# Altium schematic sheet Modified_Dub_Siren.SchDoc
size Legal; SheetNumber: 1; SheetTotal: 1; ENG_APP_DATE: --/--/--; DSN_APP_DATE: --/--/--; CHK_APP_DATE: --/--/--
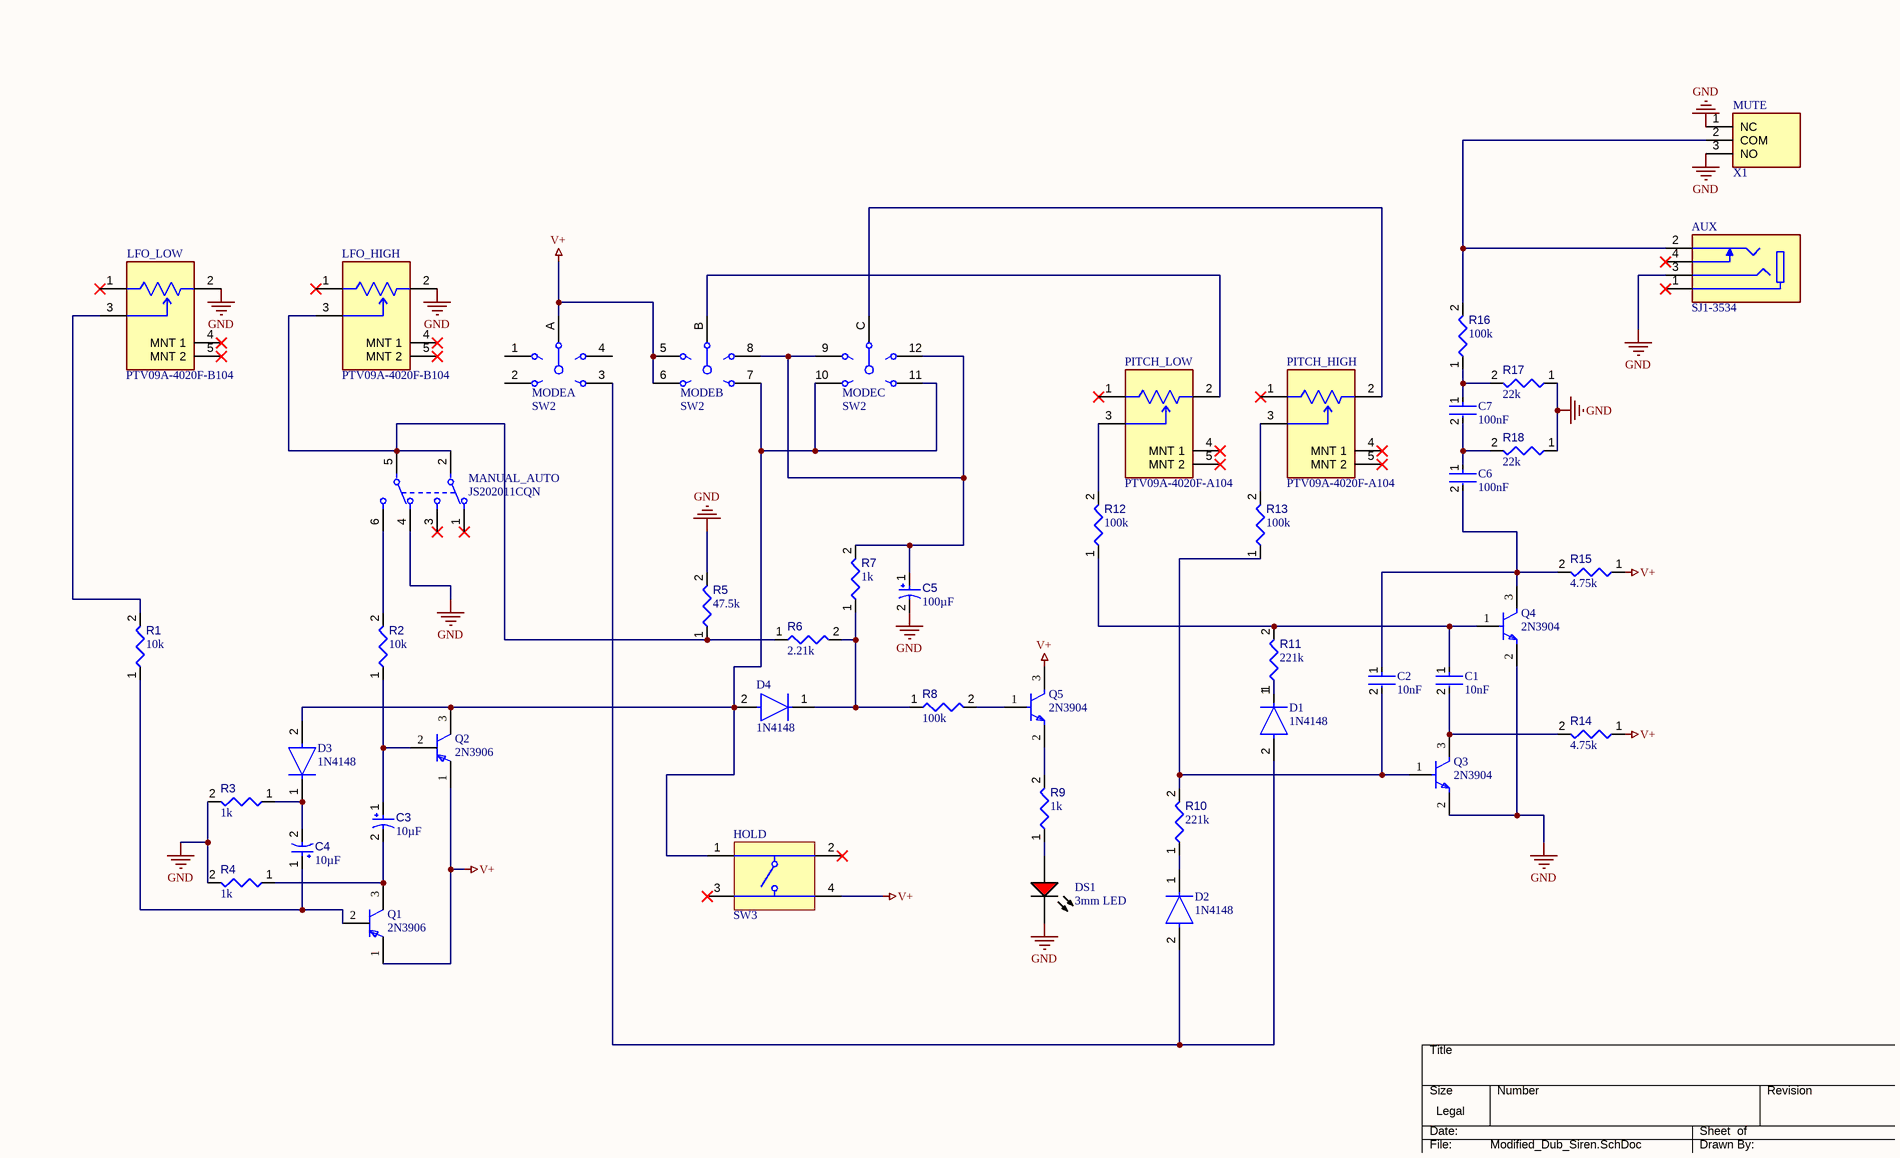
[diagram p0: Modified_Dub_Siren.SchDoc]

## Parts
AUX  SJ1-3534  [CUI_SJ1-3533]
C1  10nF  [FP-K15H5-MFG]
C2  10nF  [FP-K15H5-MFG]
C3  value 10µF  [CAPPR55-200-1100X500X1200]  (hidden comment: ECA1HM100)
C4  value 10µF  [CAPPR55-200-1100X500X1200]  (hidden comment: ECA1HM100)
C5  value 100µF  [CAPPR55-200-1100X500X1200]  (hidden comment: ECA1HM100)
C6  100nF  [FP-K15H5-MFG]
C7  100nF  [FP-K15H5-MFG]
D1  1N4148  [FP-017AG-MFG]
D2  1N4148  [FP-017AG-MFG]
D3  1N4148  [FP-017AG-MFG]
D4  1N4148  [FP-017AG-MFG]
DS1  3mm LED  [LED-2P-2.28-3MM_A]
HOLD  SW3  [BEST-TS-1109_V]
LFO_HIGH  PTV09A-4020F-B104  [FP-PTV09A-4020-MFG]
LFO_LOW  PTV09A-4020F-B104  [FP-PTV09A-4020-MFG]
MANUAL_AUTO  JS202011CQN  [FP-JS202011AQN-MFG]
MODE  SW2  [CKCP-A30415RNZQ-15_V]  (parts A,B,C of 3)
MUTE  X1  [100SP5T1B1M2QEH]
PITCH_HIGH  PTV09A-4020F-A104  [FP-PTV09A-4020-MFG]
PITCH_LOW  PTV09A-4020F-A104  [FP-PTV09A-4020-MFG]
Q1  2N3906  [FP-135AR-MFG]
Q2  2N3906  [FP-135AR-MFG]
Q3  2N3904  [FP-135AR-MFG]
Q4  2N3904  [FP-135AR-MFG]
Q5  2N3904  [FP-135AR-MFG]
R1  value 10k  [RESA60-630X240]  (hidden comment: MFR-25FBF52-10K)
R2  value 10k  [RESA60-630X240]  (hidden comment: MFR-25FBF52-10K)
R3  value 1k  [RESA60-630X240]  (hidden comment: MFR-25FBF52-1K)
R4  value 1k  [RESA60-630X240]  (hidden comment: MFR-25FBF52-1K)
R5  value 47.5k  [RESA60-630X240]  (hidden comment: MFR-25FBF52-47K5)
R6  value 2.21k  [RESA60-630X240]  (hidden comment: MFR-25FBF52-2K21)
R7  value 1k  [RESA60-630X240]  (hidden comment: MFR-25FBF52-1K)
R8  value 100k  [RESA60-630X240]  (hidden comment: MFR-25FBF52-100K)
R9  value 1k  [RESA60-630X240]  (hidden comment: MFR-25FBF52-1K)
R10  value 221k  [RESA60-630X240]  (hidden comment: MFR-25FBF52-221K)
R11  value 221k  [RESA60-630X240]  (hidden comment: MFR-25FBF52-221K)
R12  value 100k  [RESA60-630X240]  (hidden comment: MFR-25FBF52-100K)
R13  value 100k  [RESA60-630X240]  (hidden comment: MFR-25FBF52-100K)
R14  value 4.75k  [RESA60-630X240]  (hidden comment: MFR-25FBF52-4K75)
R15  value 4.75k  [RESA60-630X240]  (hidden comment: MFR-25FBF52-4K75)
R16  value 100k  [RESA60-630X240]  (hidden comment: MFR-25FBF52-100K)
R17  value 22k  [RESA60-630X240]  (hidden comment: MFR-25FBF52-22K1)
R18  value 22k  [RESA60-630X240]  (hidden comment: MFR-25FBF52-22K1)

## Nets
GND: AUX.3 C5.2 DS1.2(K) LFO_HIGH.2 LFO_LOW.2 MANUAL_AUTO.4 MUTE.1(NC) MUTE.3(NO) Q3.2(E) Q4.2(E) R3.2 R4.2 R5.2 R17.1 R18.1
V+: HOLD.4 MODE.5 MODE.6 MODE.A Q1.1(E) Q2.1(E) Q5.3(C) R14.1 R15.1
NetAUX_2: AUX.2 MUTE.2(COM) R16.2
NetC1_1: C1.1 Q4.1(B) R11.2 R12.1
NetC1_2: C1.2 Q3.3(C) R14.2
NetC2_1: C2.1 C6.2 Q4.3(C) R15.2
NetC2_2: C2.2 Q3.1(B) R10.2 R13.1
NetC3_1: C3.1 Q2.2(B) R2.1
NetC3_2: C3.2 Q1.3(C) R4.1
NetC4_1: C4.1 Q1.2(B) R1.1
NetC4_2: C4.2 D3.1(C) R3.1
NetC5_1: C5.1 MODE.8 MODE.9 MODE.12 R7.2
NetC6_1: C6.1 C7.2 R18.2
NetC7_1: C7.1 R16.1 R17.2
NetD1_1: D1.1(C) R11.1
NetD1_2: D1.2(A) D2.2(A) MODE.3
NetD2_1: D2.1(C) R10.1
NetD3_2: D3.2(A) D4.2(A) HOLD.1 MODE.7 MODE.10 MODE.11 Q2.3(C)
NetD4_1: D4.1(C) R6.2 R7.1 R8.1
NetDS1_1: DS1.1(A) R9.1
NetLFO_HIGH_3: LFO_HIGH.3 MANUAL_AUTO.2 MANUAL_AUTO.5 R5.1 R6.1
NetLFO_LOW_3: LFO_LOW.3 R1.2
NetMANUAL_AUTO_6: MANUAL_AUTO.6 R2.2
NetMODE_B: MODE.B PITCH_LOW.2
NetMODE_C: MODE.C PITCH_HIGH.2
NetPITCH_HIGH_3: PITCH_HIGH.3 R13.2
NetPITCH_LOW_3: PITCH_LOW.3 R12.2
NetQ5_1: Q5.1(B) R8.2
NetQ5_2: Q5.2(E) R9.2

Not connected (* = marked no-connect by the designer): AUX 1* 4*; HOLD 2* 3*; LFO_HIGH 1* 4(MNT_1)* 5(MNT_2)*; LFO_LOW 1* 4(MNT_1)* 5(MNT_2)*; MANUAL_AUTO 1* 3*; MODE 1 2 4; PITCH_HIGH 1* 4(MNT_1)* 5(MNT_2)*; PITCH_LOW 1* 4(MNT_1)* 5(MNT_2)*

## Notes on the sheet
- DWG NO:
- REV:
- THIS DOCUMENT AND THE DATA DISCLOSED HEREIN OR
- HEREWITH IS THE PROPERTY OF ALTIUM LIMITED AND MAY
- BE FREELY DISTRIBUTED IN WHOLE. NO RIGHTS ARE
- RESERVED OR EXPRESS OR IMPLIED WARANTEE GIVEN.
- REVISION
- DESCRIPTION
- DATE
- APPROVED
- ENG:
- APPROVALS
- PROJECT
- DSN:
- CHK:
- REFERENCE DOCUMENTS
- PROJECT REVISION:
- TITLE
- DOCUMENT REVISION:
- DESIGN ITEM:
- BOM:
- FAB DWG:
- PCB DWG:
- ASSY DWG:
- SCALE:
- A2
- SIZE
- CAGE CODE
- FILE NAME
- DWG NO.
- SHEET
- OF
- REV

## Library data of the parts
AUX = SJ1-3534: 3.5 mm Right-Angle Stereo Jack, 4 Pin PCB Mount, Threaded w/ Nut; MF: Same Sky; SnapEDA_Link: https://www.snapeda.com/parts/SJ1-3534/Same+Sky/view-part/?ref=snap; Package: None; Value: *; MP: SJ1-3534; Check_prices: https://www.snapeda.com/parts/SJ1-3534/Same+Sky/view-part/?ref=eda
C1 C2 = CMP-02417-000048-1: CAP CER 0.1UF 50V X7R RADIAL; Capacitance: 100nF; Tolerance: 10%; Lead/Base Style: Formed Leads; Lead Length: 30mm; Lead Diameter: 0.5mm; Radiation Hardening: No; Lead Pitch: 5mm; Voltage: 50V; Mount: Through Hole; Package Quantity: 5000; Series: K; Case/Package: Dipped; Min Operating Temperature: -55°C; Depth: 2.5mm; Height - Seated (Max): 0.1inch; Voltage Rating (DC): 50V; Packaging: Bulk; RoHS Compliant: Yes; Construction: RADIAL; Thickness: 2.6mm; Max Operating Temperature: 125°C; Voltage Rating: 50V; Diameter: 500um; Dielectric: X7R; Width: 2.5mm; Length: 4mm; Weight: 0.005644oz; Termination: Radial; Height: 4mm
C3-C5 = CMP-001-00025-7: Aluminum Electrolytic Capacitor, 10 uF, +/- 20%, 50 V, -40 to 85 degC, 2-Pin THD, RoHS, Bulk; Manufacturer: Panasonic; Ripple Current (AC): 65mA; Voltage Rating: 50V; Mounting Technology: TH; RoHS Compliant: True; Capacitor Type: Electrolytic; Datasheet Version: Rev. 05, 10/2016; Min Operating Temperature: -40°C; Packaging: Bulk; Ripple Current: 65mA; Tolerance: 20%; Max Operating Temperature: 85°C; Datasheet URL: https://industrial.panasonic.com/cdbs/www-data/pdf/RDF0000/ABA0000C1218.pdf; Lead Pitch: 2mm; Pins: 2; Diameter: 5mm; Manufacturer URL: http://www.panasonic.com/; Package Reference: CAPPR55-200-1100X500X1200; Package Description: 2-Pin Radial Lead, Dia 5 mm, Height 12 mm; Case/Package: Radial; Package Quantity: 200
C6 C7 = CMP-02417-000048-1: CAP CER 0.1UF 50V X7R RADIAL; Tolerance: 10%; Lead/Base Style: Formed Leads; Lead Length: 30mm; Lead Diameter: 0.5mm; Radiation Hardening: No; Capacitance: 100nF; Lead Pitch: 5mm; Voltage: 50V; Mount: Through Hole; Package Quantity: 5000; Series: K; Case/Package: Dipped; Min Operating Temperature: -55°C; Depth: 2.5mm; Height - Seated (Max): 0.1inch; Voltage Rating (DC): 50V; Packaging: Bulk; RoHS Compliant: Yes; Construction: RADIAL; Thickness: 2.6mm; Max Operating Temperature: 125°C; Voltage Rating: 50V; Diameter: 500um; Dielectric: X7R; Width: 2.5mm; Length: 4mm; Weight: 0.005644oz; Termination: Radial; Height: 4mm
D1-D4 = CMP-07163-000046-1: DIODE GEN PURP 100V 200MA DO35; Forward Voltage: 1V; Max Power Dissipation: 500mW; Max Reverse Current: 5uA; Forward Current: 300mA; Current: 4A; Reverse Recovery Time: 4ns; Element Configuration: Single; Outside Diameter: 1.85mm; Capacitance: 4pF; Polarity: Standard; Max Forward Surge Current (Ifsm): 1A; Reverse Voltage: 100V; Output Current: 200mA; Average Rectified Current: 200mA; Diameter: 1.91mm; Max Repetitive Reverse Voltage (Vrrm): 100V; Current Rating: 200mA; Case/Package: DO-35; Lead Free: Lead Free; Number of Pins: 2; Recovery Time: 4ns; Packaging: Bulk; Contact Plating: Tin; Voltage: 100V; Mount: Through Hole; Max Surge Current: 4A; Package Quantity: 2000; Width: 1.91mm; Max Reverse Voltage (DC): 100V; Length: 4.56mm; Radiation Hardening: No; Power Dissipation: 500mW; Voltage Rating (DC): 100V; Peak Non-Repetitive Surge Current: 4A; REACH SVHC: No SVHC; Height: 4.56mm; Max Operating Temperature: 175°C; Series: -; Weight: 0.01lb; Min Operating Temperature: -65°C
DS1 = CMP-007-00007-2: Red LED, 80 mW, 30 mA, -25 to 85 degC, 2-Pin THD; Manufacturer: Shenzhen CGX; Package Description: 2-Pin Through Hole Device, Dia 3 mm, Pitch 2.28 mm; Datasheet URL: http://datasheet.octopart.com/304090041-Chengguangxing-datasheet-62330656.pdf; Mounting Technology: TH; Manufacturer URL: http://szcgx.com/; RoHS Compliant: Unknown; Datasheet Version: Sep-14; Case/Package: 304090041; Package Reference: 304090041
HOLD = CMP-011-00002-2: Tactile Switch, SPST, 12 V, 50 mA, -20 to 80 degC, 4-Pin THD; Manufacturer: Shenzhen Best; RoHS Compliant: Unknown; Manufacturer URL: www.best-dz.com/; Case/Package: TS-1109; Package Reference: TS-1109; Datasheet Version: Dec-12; Mounting Technology: TH; Package Description: 4-Pin Through Hole Device, Body 6.2 x 6.2 mm; Datasheet URL: http://datasheet.octopart.com/TS-1109-Best-Inc.-datasheet-30458100.pdf
LFO_HIGH LFO_LOW PITCH_HIGH PITCH_LOW = CMP-07234-000017-1: POT 20K OHM 1/20W CARBON LOG; Manufacturer: Bourns Inc.; Manufacturer Part Number: PTV09A-4020F-A203; Tolerance: 20%; Voltage Rating: 50V; Power Rating: 0.05W; Resistance: 20kΩ; Value: 20kΩ; Series: PTV09; Device Class L1: Passive Components; Mouser Description: Potentiometers 20K AUDIO 20%; Device Class L3: Variable Resistors and Potentiometers; Lead Free: Yes; Package: PTV09A-4020; ComponentLink2URL: https://www.bourns.com/docs/product-datasheets/ptv09.pdf?sfvrsn=5e1089f1_12; Octopart: https://octopart.com/ptv09a-4020f-a203-bourns-1637636; Temperature: -10°C to +50°C; Height: 20.5mm; ComponentLink2Description: Datasheet; Category: Res; Digikey Description: POT 20K OHM 1/20W CARBON LOG; Temperature Range High: +50°C; RoHS: TRUE; Device Class L2: Resistors; Composition: Carbon; Automotive: No; Temperature Range Low: -10°C
MANUAL_AUTO = CMP-10038-000021-1: SWITCH SLIDE DPDT 300MA 6V; Actuator Type: Standard; Actuator Color: Black; Switch Travel: 2mm; Actuator Material: Nylon; Contact Resistance: 70mR; Switch Function: On-On; Illumination Type: Non-Illuminated; Electrical Life: 5000Cycles; Contact Plating: Silver; Max Operating Temperature: 85°C; Mount: Through Hole; Depth: 5.6mm; Min Operating Temperature: -40°C; Throw Configuration: DPDT; Housing Material: Nylon; Packaging: Bulk; Termination: PC Pins; Contact Current Rating: 300mA; Radiation Hardening: No; RoHS Compliant: Yes; Max Current Rating: 300mA; REACH SVHC: No SVHC; Length: 9mm; Contact Material: Copper Alloy; Max Voltage Rating (DC): 6V; Actuator Length: 2mm; Package Quantity: 1; Orientation: Right Angle; Current Rating: 300mA; Voltage Rating (DC): 6V; Series: JS
MODE = CMP-1076-00011-1: A Series Rotary Switch, 3 Poles, 4 Positions, 30 deg Angle of Throw, -30 to 85 degC, RoHS; PartNumber: A30415RNZQE; Manufacturer: C&K Components; Angle of Throw: 30 deg; Pole: 3; Position: 4; ComponentLink3URL: http://www.ck-components.com/13397/arotary_9apr14.pdf/; ComponentLink1URL: http://www.ck-components.com/; PackageReference: A30415RNZQ-15; Mounting Technology: Through Hole; ComponentLink2URL: http://www.ck-components.com/13397/arotary_9apr14.pdf/; ComponentLink2Description: Datasheet; Temperature Range: -30 to 85 degC; Series: A; RoHS: TRUE; ComponentLink1Description: Manufacturer URL; DatasheetVersion: 41821; PackageDescription: 15-Pin Through Hole Device, Dia 26.19 mm, Height 60.59 mm; ComponentLink3Description: Package Specification
MUTE = 100SP5T1B1M2QEH: TOGGLE, 5A, 120VAC/28VDC SPDT, On-Off-(On) Panel Mount, Through Hole; Manufacturer_Name: E-Switch; Geometry.Height: 28.44mm; Manufacturer_Part_Number: 100SP5T1B1M2QEH; Mouser Part Number: 612-100-E1121; Mouser Price/Stock: https://www.mouser.co.uk/ProductDetail/E-Switch/100SP5T1B1M2QEH?qs=7Bi7Dg8SEnz4%252B%252BHvW9Rm0A%3D%3D; Arrow Part Number: *; Arrow Price/Stock: *; Datasheet Link: https://configured-product-images.s3.amazonaws.com/2D/specs/100SP5T1B1M2QEH.pdf
Q1 Q2 = CMP-00278-84408866-1: 2N3906TF Small Signal Bipolar Transistor, 0.2A I(C), 40V V(BR)CEO, 1-Element, PNP, Silicon, TO-92; Manufacturer Lifecycle Status: ACTIVE; Collector Base Voltage (VCBO): -40V; Frequency: 250MHz; Number of Elements: 1; Max Power Dissipation: 625mW; Max Breakdown Voltage: 160V; Current Rating: -200mA; Emitter Base Voltage (VEBO): -5V; Collector Emitter Saturation Voltage: -400mV; Element Configuration: Single; Max Junction Temperature (Tj): 150°C; hFE Min: 100; Polarity: PNP; Lead Free: Lead Free; RoHS: Compliant; Max Operating Temperature: 150°C; Collector Emitter Voltage (VCEO): -40V; Max Frequency: 250MHz; Power Dissipation: 625mW; Height: 5.33mm; Schedule B: 8541210080; Mount: Through Hole; Length: 5.2mm; REACH SVHC: No SVHC; Min Operating Temperature: -55°C; Gain Bandwidth Product: 250MHz; Number of Pins: 3; Lifecycle Status: Production; Transition Frequency: 250MHz; NexarPartId: 84408866; Collector Emitter Breakdown Voltage: -40V; Case/Package: TO-92; Packaging: Tape and Reel; Width: 4.19mm; Max Collector Current: -200mA; Radiation Hardening: No; Weight: 240mg; Voltage Rating (DC): -40V
Q3-Q5 = CMP-00278-84329632-1: KSP10TA Transistor, bjt, npn, 25V V(Br)Ceo, to-92 Rohs Compliant: Yes; Manufacturer Lifecycle Status: ACTIVE; Current Rating: 100mA; Max Frequency: 100MHz; Transition Frequency: 650MHz; Max Power Dissipation: 350mW; Max Collector Current: 4mA; Number of Elements: 1; Collector Base Voltage (VCBO): 30V; Emitter Base Voltage (VEBO): 3V; hFE Min: 60; Max Junction Temperature (Tj): 150°C; Element Configuration: Single; Collector Emitter Saturation Voltage: 500mV; Case/Package: TO-92-3; Collector Emitter Voltage (VCEO): 25V; RoHS: Compliant; Length: 4.58mm; Height: 8.77mm; Power Dissipation: 350mW; Lifecycle Status: Production; Frequency: 650MHz; Lead Free: Lead Free; Weight: 240mg; Number of Pins: 3; NexarPartId: 84329632; Collector Emitter Breakdown Voltage: 25V; Voltage Rating (DC): 25V; Polarity: NPN; Mount: Through Hole; Max Operating Temperature: 150°C; Radiation Hardening: No; Width: 3.86mm; Max Breakdown Voltage: 25V; Gain Bandwidth Product: 650MHz; Min Operating Temperature: -55°C
R1 R2 = CMP-009-00047-4: Axial Resistor, 10 KOhm, +/- 1%, 0.25 W, -55 to 155 degC, 2-Pin THD, RoHS, Bulk; Manufacturer: Yageo; Power: 250mW; Voltage Rating: 250V; Case/Package: Axial; Min Operating Temperature: -55°C; Mounting Technology: TH; Tolerance: 1%; Max Operating Temperature: 155°C; RoHS Compliant: True; Manufacturer URL: http://www.yageo.com/; Datasheet URL: http://www.yageo.com/documents/recent/Yageo%20LR_MFR_2013.pdf; Package Reference: MFR-25; Package Quantity: 200; Datasheet Version: Apr-13; Packaging: Bulk; Package Description: 2-Pin Axial Lead, Dia 2.4 mm, Body Length 6.3 mm
R3 R4 R7 R9 = CMP-009-00048-4: Axial Resistor, 1 KOhm, +/- 1%, 250 mW, -55 to 155 degC, 2-Pin THD, RoHS, Bulk; Manufacturer: Yageo; Power: 250mW; Voltage Rating: 250V; Case/Package: Axial; Min Operating Temperature: -55°C; Mounting Technology: TH; Tolerance: 1%; Max Operating Temperature: 155°C; RoHS Compliant: True; Package Reference: MFR-25; Composition: CarbonFilm; Packaging: Bulk; Datasheet URL: http://www.yageo.com/documents/recent/Yageo%20LR_MFR_2013.pdf; Package Quantity: 200; Manufacturer URL: http://www.yageo.com/; Package Description: 2-Pin Axial Lead, Dia 2.4 mm, Body Length 6.3 mm; Datasheet Version: Apr-13
R5 = CMP-009-00057-4: Axial Resistor, 47.5 KOhm, +/- 1%, 0.25 W, -55 to 155 degC, 2-Pin THD, RoHS, Bulk; Manufacturer: Yageo; Power: 250mW; Voltage Rating: 250V; Case/Package: Axial; Min Operating Temperature: -55°C; Mounting Technology: TH; Tolerance: 1%; Max Operating Temperature: 155°C; RoHS Compliant: True; Packaging: Bulk; Manufacturer URL: http://www.yageo.com/; Package Quantity: 200; Datasheet URL: http://www.yageo.com/documents/recent/Yageo%20LR_MFR_2013.pdf; Package Reference: MFR-25; Package Description: 2-Pin Axial Lead, Dia 2.4 mm, Body Length 6.3 mm; Datasheet Version: Apr-13
R6 = CMP-009-00054-4: Axial Resistor, 2.21 KOhm, +/- 1%, 0.25 W, -55 to 155 degC, 2-Pin THD, RoHS, Bulk; Manufacturer: Yageo; Power: 250mW; Voltage Rating: 250V; Case/Package: Axial; Min Operating Temperature: -55°C; Mounting Technology: TH; Tolerance: 1%; Max Operating Temperature: 155°C; RoHS Compliant: True; Package Reference: MFR-25; Packaging: Bulk; Datasheet Version: Apr-13; Manufacturer URL: http://www.yageo.com/; Package Description: 2-Pin Axial Lead, Dia 2.4 mm, Body Length 6.3 mm; Package Quantity: 200; Datasheet URL: http://www.yageo.com/documents/recent/Yageo%20LR_MFR_2013.pdf
R8 R12 R13 R16 = CMP-009-00045-4: Axial Resistor, 100 KOhm, +/- 1%, 0.25 W, -55 to 155 degC, 2-Pin THD, RoHS, Bulk; Manufacturer: Yageo; Power: 250mW; Voltage Rating: 250V; Case/Package: Axial; Min Operating Temperature: -55°C; Mounting Technology: TH; Tolerance: 1%; Max Operating Temperature: 155°C; RoHS Compliant: True; Package Reference: MFR-25; Package Quantity: 200; Package Description: 2-Pin Axial Lead, Dia 2.4 mm, Body Length 6.3 mm; Manufacturer URL: http://www.yageo.com/; Packaging: Bulk; Datasheet Version: Apr-13; Datasheet URL: http://www.yageo.com/documents/recent/Yageo%20LR_MFR_2013.pdf
R10 R11 = CMP-009-00050-4: Axial Resistor, 221 KOhm, +/- 1%, 0.25 W, -55 to 155 degC, 2-Pin THD, RoHS, Bulk; Manufacturer: Yageo; Power: 250mW; Voltage Rating: 250V; Case/Package: Axial; Min Operating Temperature: -55°C; Mounting Technology: TH; Tolerance: 1%; Max Operating Temperature: 155°C; RoHS Compliant: True; Package Reference: MFR-25; Package Quantity: 200; Packaging: Bulk; Package Description: 2-Pin Axial Lead, Dia 2.4 mm, Body Length 6.3 mm; Datasheet Version: Apr-13; Datasheet URL: http://www.yageo.com/documents/recent/Yageo%20LR_MFR_2013.pdf; Manufacturer URL: http://www.yageo.com/
R14 R15 = CMP-009-00059-4: Axial Resistor, 4.75 KOhm, +/- 1%, 0.25 W, -55 to 155 degC, 2-Pin THD, RoHS, Bulk; Manufacturer: Yageo; Power: 250mW; Voltage Rating: 250V; Case/Package: Axial; Min Operating Temperature: -55°C; Mounting Technology: TH; Tolerance: 1%; Max Operating Temperature: 155°C; RoHS Compliant: True; Datasheet Version: Apr-13; Package Reference: MFR-25; Composition: MetalFilm; Datasheet URL: http://www.yageo.com/documents/recent/Yageo%20LR_MFR_2013.pdf; Package Quantity: 200; Package Description: 2-Pin Axial Lead, Dia 2.4 mm, Body Length 6.3 mm; Packaging: Bulk; Manufacturer URL: http://www.yageo.com/
R17 R18 = CMP-009-00052-4: Axial Resistor, 22.1 KOhm, +/- 1%, 0.25 W, -55 to 155 degC, 2-Pin THD, RoHS, Bulk; Manufacturer: Yageo; Power: 250mW; Voltage Rating: 250V; Case/Package: Axial; Min Operating Temperature: -55°C; Mounting Technology: TH; Tolerance: 1%; Max Operating Temperature: 155°C; RoHS Compliant: True; Packaging: Bulk; Package Quantity: 200; Package Reference: MFR-25; Manufacturer URL: http://www.yageo.com/; Package Description: 2-Pin Axial Lead, Dia 2.4 mm, Body Length 6.3 mm; Datasheet Version: Apr-13; Datasheet URL: http://www.yageo.com/documents/recent/Yageo%20LR_MFR_2013.pdf